# EAGLE design led_arm (EAGLE 5.07)
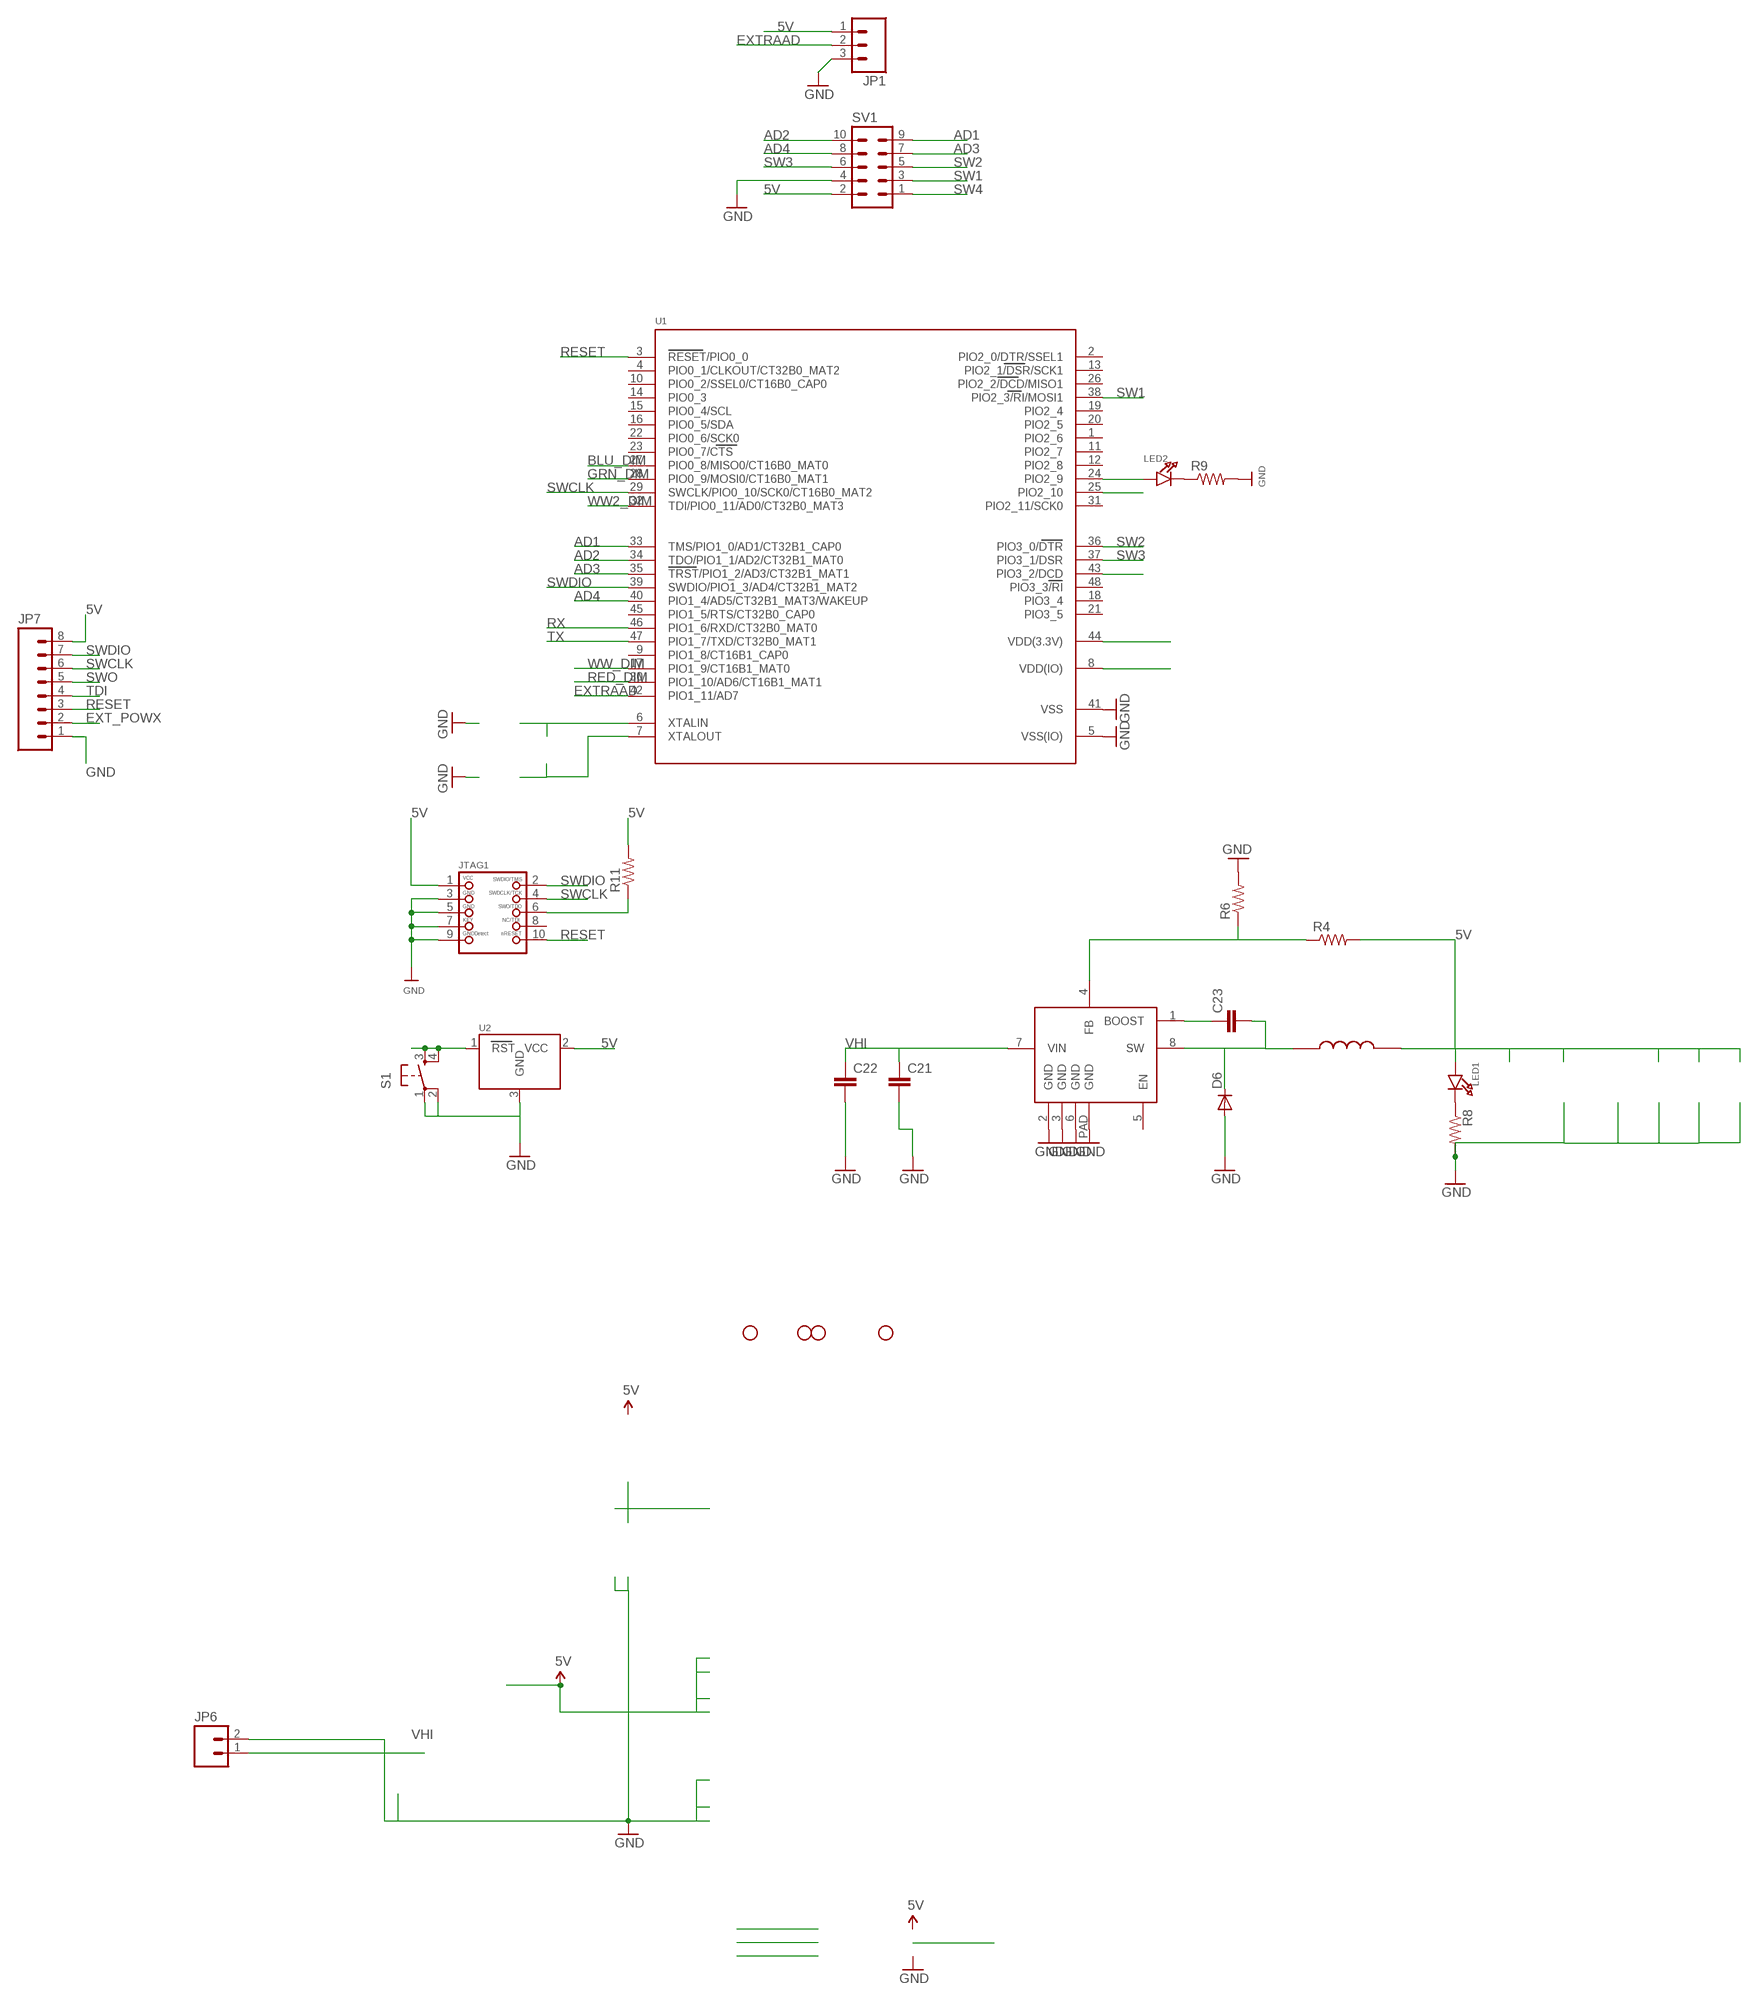
[diagram p0: schematic, sheet 1, part 1 of 2]
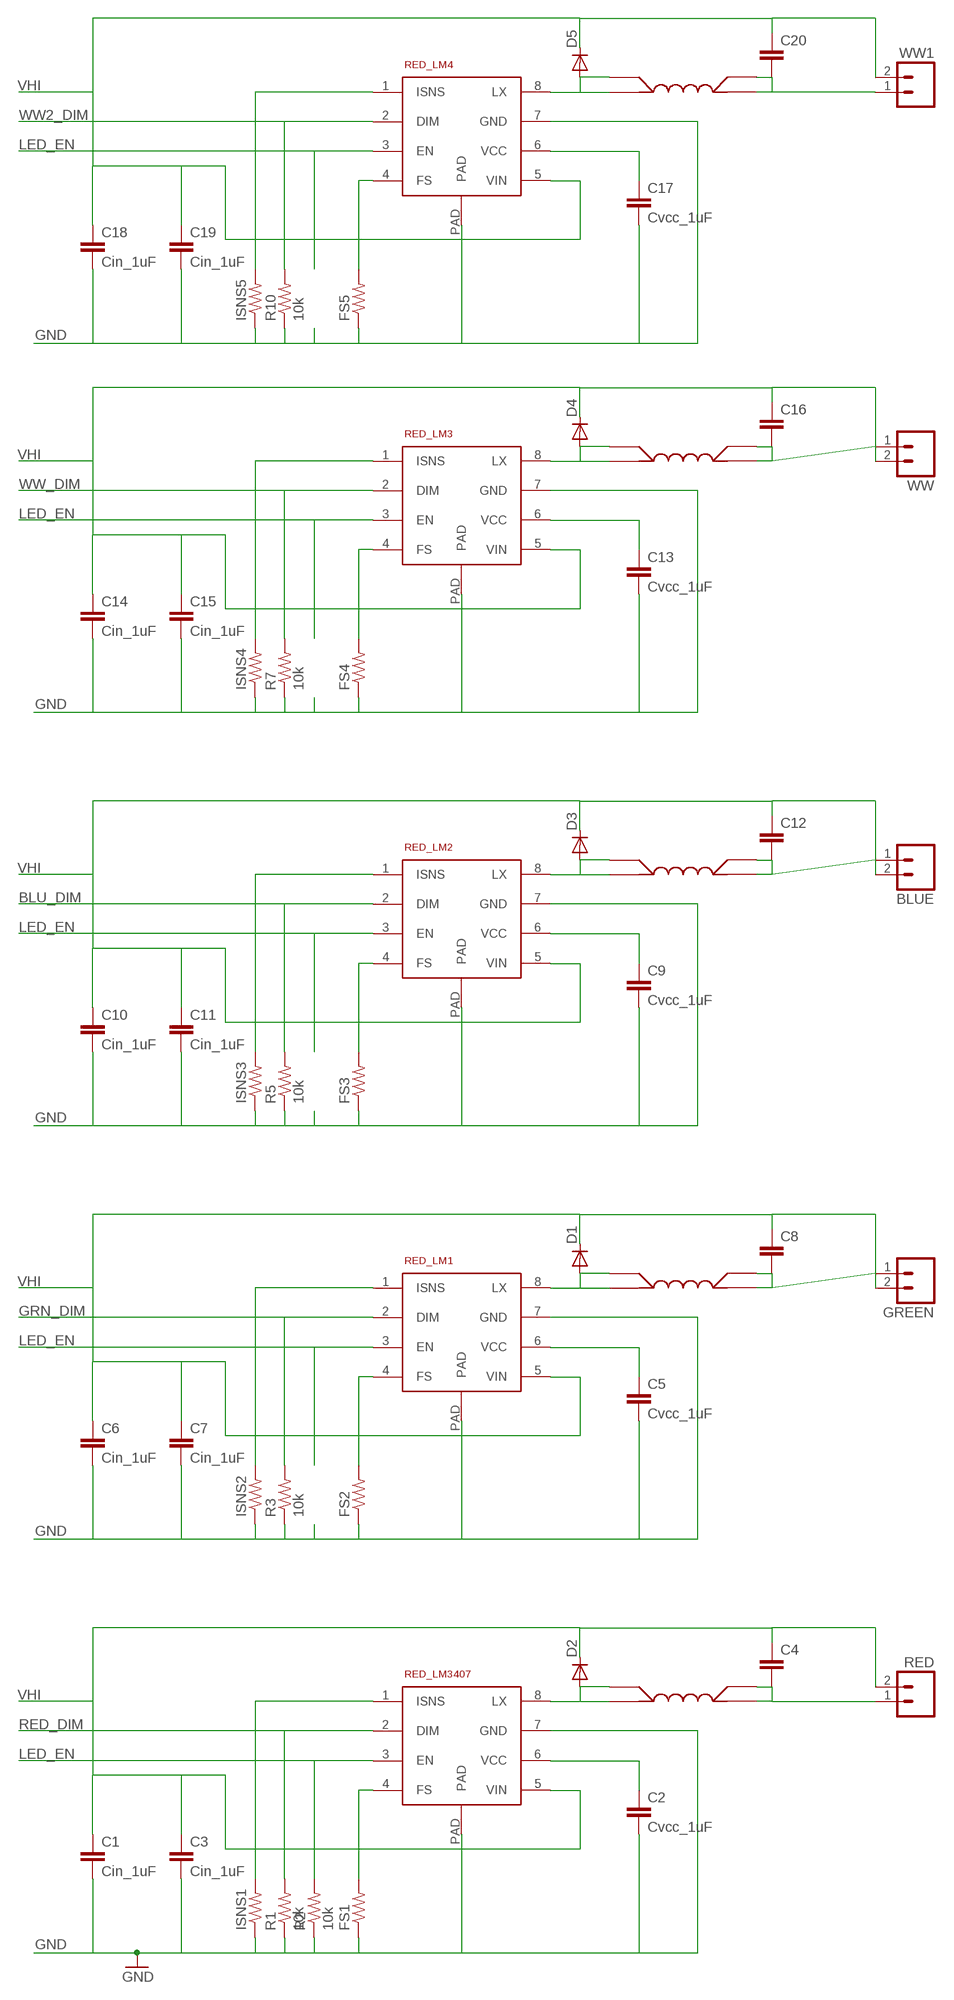
[diagram p1: schematic, sheet 1, part 2 of 2]

## Parts
BLUE  M023.5MM_LOCK  [SCREWTERMINAL-3.5MM-2_LOCK]
C1  Cin_1uF  C-EUC1206  [C1206]
C2  Cvcc_1uF  C-EUC1206  [C1206]
C3  Cin_1uF  C-EUC1206  [C1206]
C4  C-EUC1206  [C1206]
C5  Cvcc_1uF  C-EUC1206  [C1206]
C6  Cin_1uF  C-EUC1206  [C1206]
C7  Cin_1uF  C-EUC1206  [C1206]
C8  C-EUC1206  [C1206]
C9  Cvcc_1uF  C-EUC1206  [C1206]
C10  Cin_1uF  C-EUC1206  [C1206]
C11  Cin_1uF  C-EUC1206  [C1206]
C12  C-EUC1206  [C1206]
C13  Cvcc_1uF  C-EUC1206  [C1206]
C14  Cin_1uF  C-EUC1206  [C1206]
C15  Cin_1uF  C-EUC1206  [C1206]
C16  C-EUC1206  [C1206]
C17  Cvcc_1uF  C-EUC1206  [C1206]
C18  Cin_1uF  C-EUC1206  [C1206]
C19  Cin_1uF  C-EUC1206  [C1206]
C20  C-EUC1206  [C1206]
C21  C-EUC3216  [C3216]
C22  C-EUC0805  [C0805]
C23  C-EUC0805  [C0805]
D1  DIODESMA  [SMA-DIODE]
D2  DIODESMA  [SMA-DIODE]
D3  DIODESMA  [SMA-DIODE]
D4  DIODESMA  [SMA-DIODE]
D5  DIODESMA  [SMA-DIODE]
D6  DIODESMB  [SMB-DIODE]
FS1  RESISTOR  [0805]
FS2  RESISTOR  [0805]
FS3  RESISTOR  [0805]
FS4  RESISTOR  [0805]
FS5  RESISTOR  [0805]
GREEN  M023.5MM_LOCK  [SCREWTERMINAL-3.5MM-2_LOCK]
ISNS1  RESISTOR  [0805]
ISNS2  RESISTOR  [0805]
ISNS3  RESISTOR  [0805]
ISNS4  RESISTOR  [0805]
ISNS5  RESISTOR  [0805]
JP1  M03LOCK_LONGPADS  [1X03_LOCK_LONGPADS]
JP2  STAND-OFF  [STAND-OFF]
JP3  STAND-OFF  [STAND-OFF]
JP4  STAND-OFF  [STAND-OFF]
JP5  STAND-OFF  [STAND-OFF]
JP6  M02  [1X02_LONGPADS]
JP7  M08  [1X08]
JTAG1  JTAG-CORTEXM3  [2X05_1.27MM_SMT]
LED1  LED0805  [CHIPLED_0805]
LED2  LED0805  [CHIPLED_0805]
R1  10k  RESISTOR  [0805]
R2  10k  RESISTOR  [0805]
R3  10k  RESISTOR  [0805]
R4  RESISTOR  [0805]
R5  10k  RESISTOR  [0805]
R6  RESISTOR  [0805]
R7  10k  RESISTOR  [0805]
R8  RESISTOR  [0805]
R9  RESISTOR  [0805]
R10  10k  RESISTOR  [0805]
R11  RESISTOR  [0805]
RED  M023.5MM_LOCK  [SCREWTERMINAL-3.5MM-2_LOCK]
RED_LM1  LM3407  [LM3407]
RED_LM2  LM3407  [LM3407]
RED_LM3  LM3407  [LM3407]
RED_LM4  LM3407  [LM3407]
RED_LM3407  LM3407  [LM3407]
S1  TAC_SWITCHPTH  [TACTILE-PTH]
SV1  ML10  [ML10]
U1  LPC1113/4  [LQFP48]
U2  MCP130TREFLOW  [SOT23-R]
U$1  SRR4018  [SDR0805]
U$2  SRR4018  [SDR0805]
U$3  SRR4018  [SDR0805]
U$4  SRR4018  [SDR0805]
U$11  SRR4018  [SDR0805]
U$13  LM22675  [PSOP-8]
U$14  INDUCTOR  [SRU1038]
WW  M023.5MM_LOCK  [SCREWTERMINAL-3.5MM-2_LOCK]
WW1  M023.5MM_LOCK  [SCREWTERMINAL-3.5MM-2_LOCK]

## Nets
5V: JP1.1 JP7.8 JTAG1.1 LED1.A R4.2 R11.2 SV1.2 U1.8(VDD(IO)) U1.44(VDD(3.3V)) U2.2(VCC) U$14.P$2
AD1: SV1.9 U1.33(TMS/PIO1_0/AD1/CT32B1_CAP0)
AD2: SV1.10 U1.34(TDO/PIO1_1/AD2/CT32B1_MAT0)
AD3: SV1.7 U1.35(TRST/PIO1_2/AD3/CT32B1_MAT1)
AD4: SV1.8 U1.40(PIO1_4/AD5/CT32B1_MAT3/WAKEUP)
BLU_DIM: R5.2 RED_LM2.2(DIM) U1.27(PIO0_8/MISO0/CT16B0_MAT0)
EXT_POWX: JP7.2
EXTRAAD: JP1.2 U1.42(PIO1_11/AD7)
GND: C1.2 C2.2 C3.2 C5.2 C6.2 C7.2 C9.2 C10.2 C11.2 C13.2 C14.2 C15.2 C17.2 C18.2 C19.2 C21.2 C22.2 D6.A FS1.1 FS2.1 FS3.1 FS4.1 FS5.1 ISNS1.1 ISNS2.1 ISNS3.1 ISNS4.1 ISNS5.1 JP1.3 JP6.2 JP7.1 JTAG1.3 JTAG1.5 JTAG1.7 JTAG1.9 R1.1 R2.1 R3.1 R5.1 R6.2 R7.1 R8.2 R9.2 R10.1 RED_LM1.7(GND) RED_LM1.PAD RED_LM2.7(GND) RED_LM2.PAD RED_LM3.7(GND) RED_LM3.PAD RED_LM4.7(GND) RED_LM4.PAD RED_LM3407.7(GND) RED_LM3407.PAD S1.1 S1.2 SV1.4 U1.5(VSS(IO)) U1.41(VSS) U2.3(GND) U$13.2(GND) U$13.3(GND) U$13.6(GND) U$13.PAD(GND)
GRN_DIM: R3.2 RED_LM1.2(DIM) U1.28(PIO0_9/MOSI0/CT16B0_MAT1)
LED_EN: R2.2 RED_LM1.3(EN) RED_LM2.3(EN) RED_LM3.3(EN) RED_LM4.3(EN) RED_LM3407.3(EN) U1.25(PIO2_10)
N$1: C5.1 RED_LM1.6(VCC)
N$2: FS2.2 RED_LM1.4(FS)
N$3: C2.1 RED_LM3407.6(VCC)
N$4: ISNS2.2 RED_LM1.1(ISNS)
N$5: FS1.2 RED_LM3407.4(FS)
N$6: ISNS1.2 RED_LM3407.1(ISNS)
N$7: D2.A RED_LM3407.8(LX) U$2.1A U$2.1B
N$8: D1.A RED_LM1.8(LX) U$1.1A U$1.1B
N$9: R4.1 R6.1 U$13.4(FB)
N$10: C8.2 GREEN.1 U$1.2A U$1.2B
N$11: C9.1 RED_LM2.6(VCC)
N$12: FS3.2 RED_LM2.4(FS)
N$13: ISNS3.2 RED_LM2.1(ISNS)
N$14: D3.A RED_LM2.8(LX) U$3.1A U$3.1B
N$15: BLUE.1 C12.2 U$3.2A U$3.2B
N$16: C13.1 RED_LM3.6(VCC)
N$17: FS4.2 RED_LM3.4(FS)
N$18: ISNS4.2 RED_LM3.1(ISNS)
N$19: D4.A RED_LM3.8(LX) U$4.1A U$4.1B
N$20: C16.2 U$4.2A U$4.2B WW.1
N$21: LED1.C R8.1
N$23: LED2.A U1.24(PIO2_9)
N$24: LED2.C R9.1
N$26: C17.1 RED_LM4.6(VCC)
N$27: FS5.2 RED_LM4.4(FS)
N$28: ISNS5.2 RED_LM4.1(ISNS)
N$29: D5.A RED_LM4.8(LX) U$11.1A U$11.1B
N$33: C23.1 U$13.1(BOOST)
N$34: C23.2 D6.C U$13.8(SW) U$14.P$1
N$36: C4.2 RED.1 U$2.2A U$2.2B
N$37: U1.7(XTALOUT)
N$38: U1.6(XTALIN)
N$41: JTAG1.6 R11.1
N$322: C20.2 U$11.2A U$11.2B WW1.1
RED_DIM: R1.2 RED_LM3407.2(DIM) U1.30(PIO1_10/AD6/CT16B1_MAT1)
RESET: JP7.3 JTAG1.10 S1.3 S1.4 U1.3(RESET/PIO0_0) U2.1(RST)
RX: U1.46(PIO1_6/RXD/CT32B0_MAT0)
SW1: SV1.3 U1.38(PIO2_3/RI/MOSI1)
SW2: SV1.5 U1.36(PIO3_0/DTR)
SW3: SV1.6 U1.37(PIO3_1/DSR)
SW4: SV1.1 U1.43(PIO3_2/DCD)
SWCLK: JP7.6 JTAG1.4 U1.29(SWCLK/PIO0_10/SCK0/CT16B0_MAT2)
SWDIO: JP7.7 JTAG1.2 U1.39(SWDIO/PIO1_3/AD4/CT32B1_MAT2)
SWO: JP7.5
TDI: JP7.4
TX: U1.47(PIO1_7/TXD/CT32B0_MAT1)
VHI: BLUE.2 C1.1 C3.1 C4.1 C6.1 C7.1 C8.1 C10.1 C11.1 C12.1 C14.1 C15.1 C16.1 C18.1 C19.1 C20.1 C21.1 C22.1 D1.C D2.C D3.C D4.C D5.C GREEN.2 JP6.1 RED.2 RED_LM1.5(VIN) RED_LM2.5(VIN) RED_LM3.5(VIN) RED_LM4.5(VIN) RED_LM3407.5(VIN) U$13.7(VIN) WW1.2 WW.2
WW2_DIM: R10.2 RED_LM4.2(DIM) U1.32(TDI/PIO0_11/AD0/CT32B0_MAT3)
WW_DIM: R7.2 RED_LM3.2(DIM) U1.17(PIO1_9/CT16B1_MAT0)
Unconnected: JTAG1.8 U1.1(PIO2_6) U1.2(PIO2_0/DTR/SSEL1) U1.4(PIO0_1/CLKOUT/CT32B0_MAT2) U1.9(PIO1_8/CT16B1_CAP0) U1.10(PIO0_2/SSEL0/CT16B0_CAP0) U1.11(PIO2_7) U1.12(PIO2_8) U1.13(PIO2_1/DSR/SCK1) U1.14(PIO0_3) U1.15(PIO0_4/SCL) U1.16(PIO0_5/SDA) U1.18(PIO3_4) U1.19(PIO2_4) U1.20(PIO2_5) U1.21(PIO3_5) U1.22(PIO0_6/SCK0) U1.23(PIO0_7/CTS) U1.26(PIO2_2/DCD/MISO1) U1.31(PIO2_11/SCK0) U1.45(PIO1_5/RTS/CT32B0_CAP0) U1.48(PIO3_3/RI) U$13.5(EN)

## Library data of the parts
BLUE GREEN JP6 RED WW WW1 = SparkFun:M02: Header 2 Standard 2-pin 0.1" header. Use with straight break away headers (SKU : PRT-00116), right angle break away headers (PRT-00553), swiss pins (PRT-00743), machine pins (PRT-00117), and female headers (PRT-00115). Molex polarized connector foot print use with SKU : PRT-08233 with associated crimp pins and housings.
C1-C3 C5-C7 C9-C11 C13-C15 C17-C19 = resistor:C-EU: CAPACITOR, European symbol
C4 C8 C12 C16 C20-C23 = rcl:C-EU: CAPACITOR, European symbol
D1-D6 = SparkFun:DIODE: Diode These are standard reverse protection diodes and small signal diodes. SMA package can handle up to about 1A. SOD-323 can handle about 200mA. What the SOD-323 package when ordering, there are some mfgs out there that are 5-pin packages.
FS1-FS5 ISNS1-ISNS5 R1-R11 = SparkFun:RESISTOR: Resistor Basic schematic elements and footprints for 0603, 1206, and PTH 1/10th watt (small) resistors.
JP1 = SparkFun:M03: Header 3 Standard 3-pin 0.1" header. Use with straight break away headers (SKU : PRT-00116), right angle break away headers (PRT-00553), swiss pins (PRT-00743), machine pins (PRT-00117), and female headers (PRT-00115). Molex polarized connector foot print use with SKU : PRT-08232 with associated crimp pins and housings.
JP2-JP5 = SparkFun:STAND-OFF: Stand Off This is the mechanical footprint for a #4 phillips button head screw. Use the keepout ring to avoid running the screw head into surrounding components. SKU : PRT-00447
JP7 = SparkFun:M08: Header 8 Standard 8-pin 0.1" header. Use with straight break away headers (SKU : PRT-00116), right angle break away headers (PRT-00553), swiss pins (PRT-00743), machine pins (PRT-00117), and female headers (PRT-00115).
JTAG1 = microbuilder:JTAG-CORTEXM3: Serial Wire (SW-DP) Connector This standard 0.05" 10-pin connector is for use with the Cortex M0/M3's native SWD (serial wire debugger) interface (SW-DP). Some boards support a 20-pin combined JTAG+SWD connector (SWJ-DP), such as the LPC1700 family, but many smaller devices only work with SWD which typically use the smaller 10-pin SW-DP connecter (the LPC1300 family, for example, only supports SWD). 2x05 1.27mm/0.05" Connector: This is the standard SMT connector defined by ARM for all Cortex devices, and should be used in most situations and for forward-compatibility since any new devices coming to market will likely ise this connector. MOLEX 10 Pin 0.1" Connector: This 0.1" 10 pin connector has the same pin layout as the standard 0.05" connector, but is easier to work with if you are using standard jumper wires or custom cables to connect your SWD hardware. MOLEX 20 Pin 0.1" Connector: This 0.1" 20 pin connector is the same model used for ARM7/ARM9 JTAG debuggers, but is connected to match the pins on the Segger J-Link for ARM (which supports both JTAG and SWD debugging). See the following document from ARM for more information on Cortex M3 Debug Connectors: http://infocenter.arm.com/help/topic/com.arm.doc.faqs/attached/13634/cortex_debug_connectors.pdf And the following page for an overview with images of the different connector types: http://www.keil.com/peripherals/coresight/connectors.asp
LED1 LED2 = microbuilder:LED: LED 0603 - 0603 Surface Mount Package Green LED - Low Power (3.9mcd, 2ma, 1.7Vf) Orange LED - Low Power (9.8mcd, 2ma, 1.8Vf) Red LED - Low Power (5mcd, 2ma, 1.8Vf) Yellow LED - Low Power (7mcd, 2ma, 1.8Vf) 0805 - 0805 Surface Mount Package Red LED (104mcd, 20mA, Diffused) - LS R976 [Digikey: 475-1278-6-ND] Red LED (12mcd, 20mA, 2.0Vf, Clear) - APT2012EC [Digikey: 754-1128-1-ND] Green LED (15mcd, 20mA, 2.2Vf, Clear) - APT2012GC [Digikey: 754-1131-1-ND] White LED (160mcd, 20mA, 2.1Vf, Clear) - APT2012SECK [Digikey: 754-1130-1-ND] 1206 - 1206 Surface Mount Package Green LED (26mcd, 20mA, Diffused) - LG N971 [Digikey: 475-1407-6-ND] Red LED (15mcd, 20mA, Diffused) - LH N974 [Digikey: 475-1416-6-ND]
RED_LM1-RED_LM4 RED_LM3407 = JoesCustom:LM3407
S1 = SparkFun:TAC_SWITCH: Momentary Switch Button commonly used for reset or general input. Spark Fun Electronics SKU : COM-00097
SV1 = con-harting-ml:ML10: HARTING
U1 = microbuilder:LPC1113/4: LPC1113/4 MCU QFP48 Package ARM Cortex M0, 50MHz Operation, 8 Channel 10-Bit ADC, 1²C, 2xSPI, UART, 2x16 Bit and 2x32 Bit Timers, Internal 12MHz Oscillator, 1.8-3.6V operation. Model Flash SRAM Part N°: Digikey # LPC1113 24KB 8KB LPC1113FBD48/301 TBD LPC1114 32KB 8KB LPC1114FBD48/301 TBD
U2 = microbuilder:MCP130T: MCP130T Voltage Supervisor (Active Low) Voltage supervisors will put the MCU in a reset state if the voltage drops below a pre-determined level. SOT23-R/SOT23-W: Voltage Supervisor - 3.15V Active Low Note: Use the "Reflow" footprint when working with solder paste, and the "Wave" footprint when soldering by hand with a soldering iron (the latter has larger pads that are easier to solder by hand). Digikey: MCP130T-315I/TTCT-ND
U$1-U$4 U$11 = JoesCustom:SRR4018
U$13 = JoesCustom:LM22675
U$14 = JoesCustom:INDUCTOR

## Board
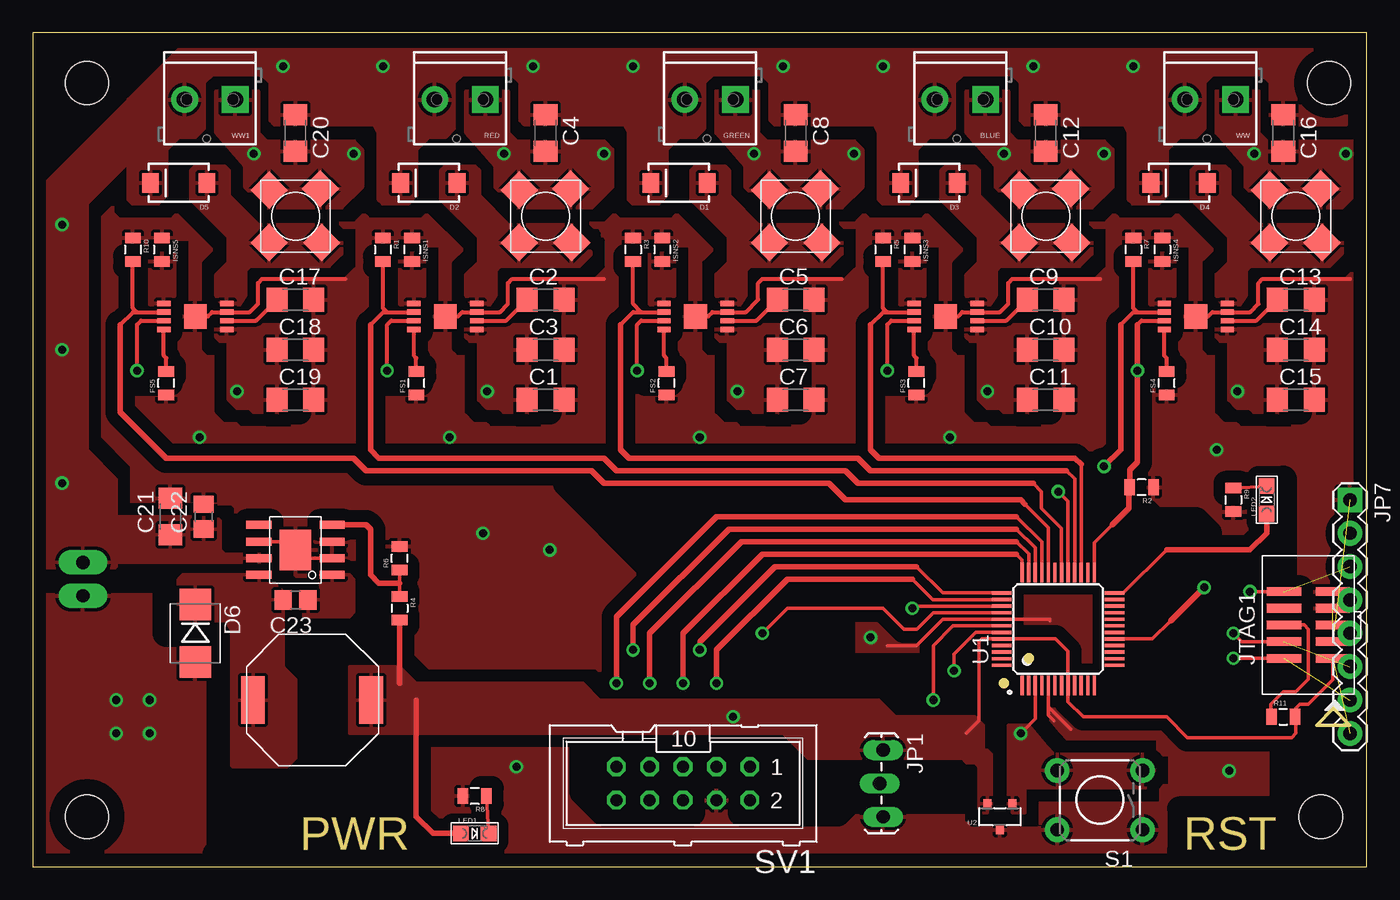
[diagram p2: board, top side]
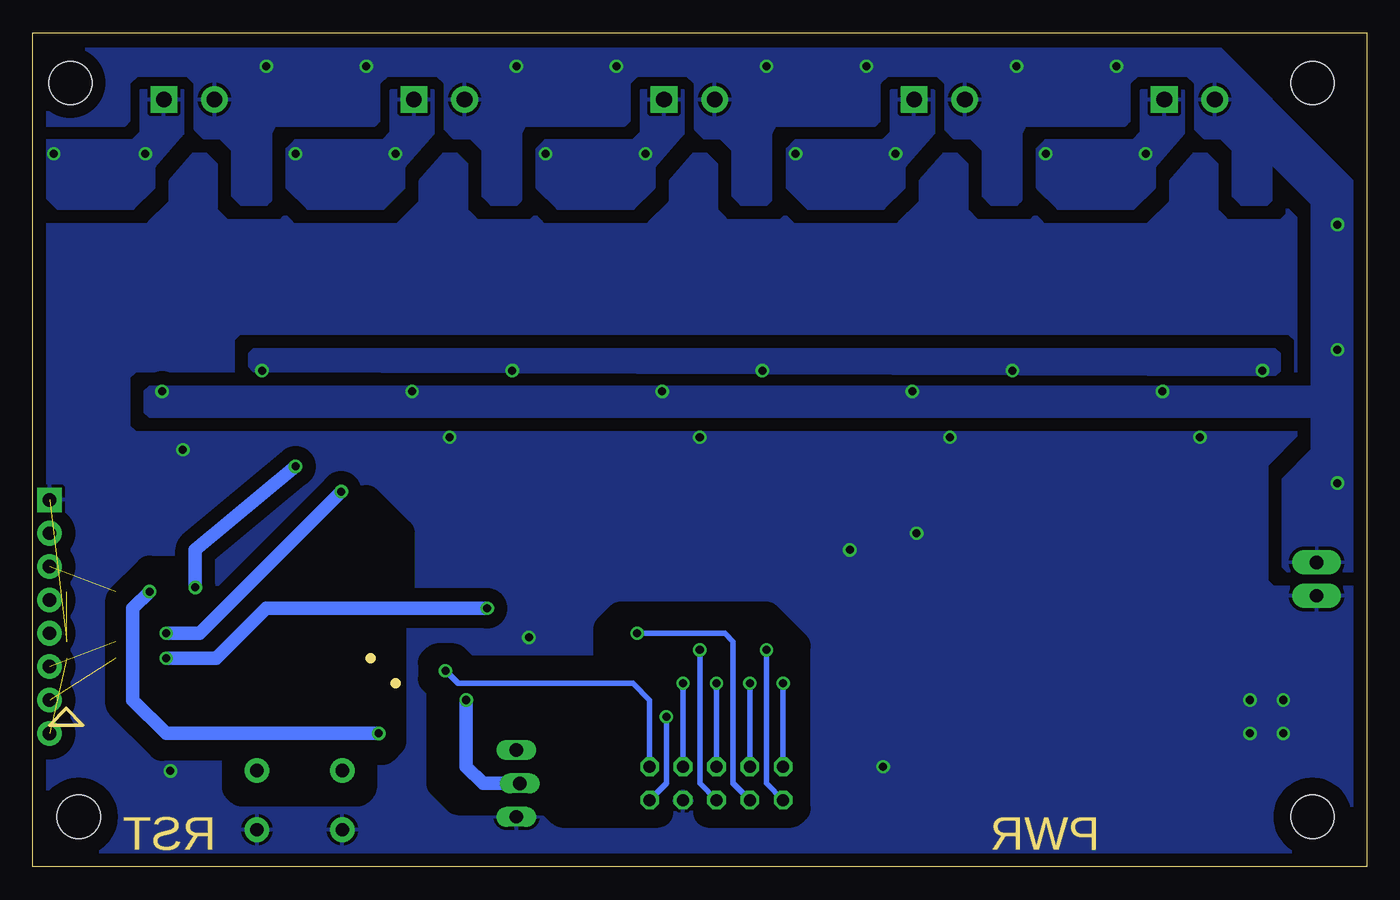
[diagram p3: board, bottom side, seen from below]

Size 101.6 x 63.5 mm. Coordinates in mm from the lower left corner, seen from the top.
Outline: 0,0 101.6,0 101.6,63.5 0,63.5 0,0
Copper layers (1*16): Top 0.035mm / dielectric 1.5mm / Bottom 0.035mm
Design rules "default *": minimum track width 10mil, minimum drill 24mil, track to track 10mil, track to pad 10mil, pad to pad 10mil, via to via 10mil, smd to smd 10mil, copper to edge 40mil, drill to drill 8mil, minimum pad ring 10mil, minimum via ring 8mil, stop-mask expansion 4mil, vias tented up to drill 0mil, thermal gap 10mil
tRestrict: area 19.7,34.6 to 20.3,43.8; area 38.7,34.6 to 39.4,43.8; area 57.8,34.6 to 58.4,43.8; area 76.8,34.6 to 77.5,43.8; area 95.9,34.6 to 96.5,43.8; area 19.7,1.3 to 27.3,4.4; area 87.3,1.3 to 94.9,4.4; 23 lines
bRestrict: 34 lines
Milling: area 97.8,10.8 to 100.3,12.1; area 75.7,15.7 to 76.1,16.1; area 73.8,13.8 to 74.2,14.1

### Footprints (pad centres in the part's own frame; a part is rotated, then mirrored left to right if it is on the bottom)
SCREWTERMINAL-3.5MM-2_LOCK = drill 1.2 pad 2.032 square: 1 -0.178,0 | drill 1.2 pad 2.032 round: 2 3.678,0
C1206 = smd 1.6 x 1.8: 1 -1.4,0; 2 1.4,0
C3216 = smd 1.6 x 1.8: 1 -1.4,0; 2 1.4,0
C0805 = smd 1.3 x 1.5: 1 -0.95,0; 2 0.95,0
SMA-DIODE = smd 1.27 x 1.47: A -2.15,0; C 2.15,0
SMB-DIODE = smd 2.4 x 2.4: A 2.2,0; C -2.2,0
0805 = smd 0.8 x 1.2: 1 -0.9,0; 2 0.9,0
1X03_LOCK_LONGPADS = drill 1.016 long: 1 0,0; 2 2.54,-0.254; 3 5.08,0
STAND-OFF = hole 3.302: 0,0
1X02_LONGPADS = drill 1.016 pad 1.88 long: 1 0,0; 2 2.54,0
1X08 = drill 1.016 pad 1.88 square: 1 0,0 | drill 1.016 pad 1.88 round: 2 2.54,0; 3 5.08,0; 4 7.62,0; 5 10.16,0; 6 12.7,0; 7 15.24,0; 8 17.78,0
2X05_1.27MM_SMT = smd 0.65 x 2.6: 1 -2.54,-1.85; 2 -2.54,1.85; 3 -1.27,-1.85; 4 -1.27,1.85; 5 0,-1.85; 6 0,1.85; 7 1.27,-1.85; 8 1.27,1.85; 9 2.54,-1.85; 10 2.54,1.85
CHIPLED_0805 = smd 1.2 x 1.2: A 0,-1.05; C 0,1.05
LM3407 = smd 0.406 x 1.016: 1 -0.991,-2.4; 2 -0.33,-2.4; 3 0.33,-2.4; 4 0.991,-2.4; 5 0.991,2.4; 6 0.33,2.4; 7 -0.33,2.4; 8 -0.991,2.4 | smd 1.854 x 1.727: PAD 0,0
TACTILE-PTH = drill 1.016 pad 1.88 round: 1 -3.251,2.261; 2 3.251,2.261; 3 -3.251,-2.261; 4 3.251,-2.261
ML10 = drill 0.914 octagon: 1 -5.08,-1.27; 2 -5.08,1.27; 3 -2.54,-1.27; 4 -2.54,1.27; 5 0,-1.27; 6 0,1.27; 7 2.54,-1.27; 8 2.54,1.27; 9 5.08,-1.27; 10 5.08,1.27
LQFP48 = smd 1.5 x 0.25: 1 -4.3,2.75; 2 -4.3,2.25; 3 -4.3,1.75; 4 -4.3,1.25; 5 -4.3,0.75; 6 -4.3,0.25; 7 -4.3,-0.25; 8 -4.3,-0.75; 9 -4.3,-1.25; 10 -4.3,-1.75; 11 -4.3,-2.25; 12 -4.3,-2.75; 25 4.3,-2.75; 26 4.3,-2.25; 27 4.3,-1.75; 28 4.3,-1.25; 29 4.3,-0.75; 30 4.3,-0.25; 31 4.3,0.25; 32 4.3,0.75; 33 4.3,1.25; 34 4.3,1.75; 35 4.3,2.25; 36 4.3,2.75 | smd 0.25 x 1.5: 13 -2.75,-4.3; 14 -2.25,-4.3; 15 -1.75,-4.3; 16 -1.25,-4.3; 17 -0.75,-4.3; 18 -0.25,-4.3; 19 0.25,-4.3; 20 0.75,-4.3; 21 1.25,-4.3; 22 1.75,-4.3; 23 2.25,-4.3; 24 2.75,-4.3; 37 2.75,4.3; 38 2.25,4.3; 39 1.75,4.3; 40 1.25,4.3; 41 0.75,4.3; 42 0.25,4.3; 43 -0.25,4.3; 44 -0.75,4.3; 45 -1.25,4.3; 46 -1.75,4.3; 47 -2.25,4.3; 48 -2.75,4.3
SOT23-R = smd 0.6 x 0.7: 1 -0.95,-1; 2 0.95,-1; 3 0,1
SDR0805 = smd 2 x 2 rotated 45: 1A -2,2; 1B 2,2; 2A -1.9,-2.1; 2B 2,-2
PSOP-8 = smd 0.61 x 1.905: 1 -1.905,-2.781; 2 -0.635,-2.781; 3 0.635,-2.781; 4 1.905,-2.781; 5 1.905,2.781; 6 0.635,2.781; 7 -0.635,2.781; 8 -1.905,2.781 | smd 3.099 x 2.413: PAD 0,0
SRU1038 = smd 1.8 x 3.6: P$1 -4.5,0; P$2 4.5,0

### Placement (x,y rotation side)
BLUE  72.39,58.42 180 top
C1  39.05,35.56 0 top
C2  39.05,43.18 0 top
C3  39.05,39.37 0 top
C4  39.05,55.88 270 top
C5  58.1,43.18 0 top
C6  58.1,39.37 0 top
C7  58.1,35.56 0 top
C8  58.1,55.88 270 top
C9  77.15,43.18 0 top
C10  77.15,39.37 0 top
C11  77.15,35.56 0 top
C12  77.15,55.88 270 top
C13  96.2,43.18 0 top
C14  96.2,39.37 0 top
C15  96.2,35.56 0 top
C16  95.25,55.88 270 top
C17  20,43.18 0 top
C18  20,39.37 0 top
C19  20,35.56 0 top
C20  20,55.88 270 top
C21  10.48,26.67 90 top
C22  13.02,26.67 90 top
C23  20,20.32 180 top
D1  49.21,52.07 180 top
D2  30.16,52.07 180 top
D3  68.26,52.07 180 top
D4  87.31,52.07 180 top
D5  11.11,52.07 180 top
D6  12.38,17.78 270 top
FS1  29.21,36.83 90 top
FS2  48.26,36.83 90 top
FS3  67.31,36.83 90 top
FS4  86.36,36.83 90 top
FS5  10.16,36.83 90 top
GREEN  53.34,58.42 180 top
ISNS1  28.89,46.99 270 top
ISNS2  47.94,46.99 270 top
ISNS3  66.99,46.99 270 top
ISNS4  86.04,46.99 270 top
ISNS5  9.84,46.99 270 top
JP1  64.77,8.89 270 top
JP2  98.11,3.81 0 bottom
JP3  4.13,59.69 0 bottom
JP4  4.13,3.81 0 bottom
JP5  98.74,59.69 0 top
JP6  3.81,23.18 270 bottom
JP7  100.33,27.94 270 top
JTAG1  97.16,18.41 90 top
LED1  33.66,2.54 270 top
LED2  93.98,27.94 0 top
R1  26.67,46.99 270 top
R2  84.45,28.89 180 top
R3  45.72,46.99 270 top
R4  27.94,19.68 270 top
R5  64.77,46.99 270 top
R6  27.94,23.5 90 top
R7  83.82,46.99 270 top
R8  33.66,5.4 180 top
R9  91.44,27.94 270 top
R10  7.62,46.99 270 top
R11  95.25,11.43 0 top
RED  34.29,58.42 180 top
RED_LM1  50.48,41.91 270 top
RED_LM2  69.53,41.91 270 top
RED_LM3  88.58,41.91 270 top
RED_LM4  12.38,41.91 270 top
RED_LM3407  31.43,41.91 270 top
S1  81.28,5.08 180 top
SV1  49.53,6.35 180 top
U1  78.11,18.1 90 top
U2  73.66,3.81 180 top
U$1  58.1,49.53 180 top
U$2  39.05,49.53 180 top
U$3  77.15,49.53 180 top
U$4  96.2,49.53 180 top
U$11  20,49.53 180 top
U$13  20,24.13 90 top
U$14  21.27,12.7 0 top
WW  91.44,58.42 180 top
WW1  15.24,58.42 180 top

### Tracks (layer width: path | path; a pad name or v marks a point on that pad's centre or on a via)
5V  (via drill 0.61)  (1 unrouted)
  Top 0.254: JTAG1.1 99,14.23 97.16,12.38 96.52,12.38 96.2,12.06 96.2,11.48 | 96.2,11.48 R11.2 | 96.2,11.48 96.2,10.16 95.89,9.84 87.95,9.84 86.36,11.43 80.01,11.43 78.86,12.59 U1.8 78.86,16.39 77.9,17.35 U1.44 72.28,17.35 72.07,17.14 72.07,11.11 71.12,10.16 | U$14.P$2 25.72,12.76
  Top 0.406: 27.94,13.97 R4.2 | LED1.A 30.48,2.54 29.21,3.81 29.21,12.7
  Bottom 0.406: v53.34,11.43 53.34,6.35 SV1.2
  pour Top (isolate 0.61): 57.15,10.16 24.13,10.16 24.13,15.24 27.94,15.24 29.21,13.97 41.91,13.97 43.18,12.7 64.45,12.7 65.72,11.43 71.75,11.43 72.39,10.79 72.39,8.89 71.75,8.26 59.05,8.26
  pour Top (isolate 0.61): 70.8,8.89 72.71,8.89 73.03,8.57 73.03,4.45 72.71,4.13 72.39,4.13 72.07,4.45 72.07,7.62 71.75,7.94 71.12,7.94 70.8,8.26
AD1  (via drill 0.61)
  Top 0.254: U1.33 76.86,24.75 74.93,26.67
  Top 0.406: 74.93,26.67 52.07,26.67 44.45,19.05 v44.45,13.97
  Bottom 0.406: SV1.9 v44.45,13.97
AD2  (via drill 0.61)
  Top 0.254: U1.34 76.36,24.29 74.93,25.72
  Top 0.406: 74.93,25.72 53.02,25.72 45.72,18.41 v45.72,16.51
  Bottom 0.406: v45.72,16.51 45.72,6.35 SV1.10
AD3  (via drill 0.61)
  Top 0.254: U1.35 75.86,23.84 74.93,24.77
  Top 0.406: 74.93,24.77 53.98,24.77 46.99,17.78 v46.99,13.97
  Bottom 0.406: SV1.7 v46.99,13.97
AD4  (via drill 0.61)
  Top 0.254: U1.40 68.6,19.35 67.35,18.1 66.36,18.1 64.77,19.68 57.47,19.68 v55.56,17.78
  Bottom 0.406: SV1.8 48.26,6.35 48.26,17.14 48.9,17.78 v55.56,17.78
BLU_DIM
  Top 0.254: 79.86,30.64 U1.27
  Top 0.305: 65.08,42.24 64.77,42.55 R5.2 | 65.08,42.24 64.78,42.24 63.82,41.27 | 65.08,42.24 RED_LM2.2
  Top 0.406: 79.86,30.64 79.38,31.11 64.45,31.11 63.82,31.75 63.82,41.27
EXTRAAD  (via drill 0.61)
  Top 0.254: U1.42 70.1,18.35 68.58,16.83 v68.58,12.7
  Bottom 1.016: v68.58,12.7 68.58,7.62 67.31,6.35 JP1.2
GND  (via drill 0.61)  (4 unrouted)
  Top 0.254: 77.79,11.11 77.36,11.54 U1.5 77.36,12.18 79.06,10.48 | 20.95,23.5 U$13.2 | U$13.6 19.37,24.77 | 65.09,16.83 67.31,16.83 69.33,18.85 U1.41 77.47,18.85 77.47,18.73
  Top 0.305: RED_LM4.PAD 13.34,41.91 13.65,42.23 14.8,42.23 | 14.8,42.23 14.92,42.23 | 14.8,42.23 RED_LM4.7 16.52,42.24 17.14,42.86 17.14,44.45 17.46,44.77 23.81,44.77 | RED_LM3407.PAD 32.38,41.91 32.72,42.24 RED_LM3407.7 35.57,42.24 36.2,42.86 36.2,44.45 36.51,44.77 43.5,44.77 | RED_LM1.PAD 51.44,41.91 51.75,42.23 52.87,42.23 RED_LM1.7 54.3,42.24 55.24,43.18 55.24,44.45 55.56,44.77 61.59,44.77 | RED_LM2.PAD 70.48,41.91 70.8,42.23 71.92,42.23 | 71.92,42.23 RED_LM2.7 | RED_LM3.PAD 89.53,41.91 89.85,42.23 90.97,42.23 RED_LM3.7 92.72,42.24 93.34,42.86 93.34,44.45 93.66,44.77 100.33,44.77 | 20.95,23.5 20.64,23.5 U$13.PAD 19.37,24.77 | 71.92,42.23 73.66,42.23 74.3,42.86 74.3,44.45 74.61,44.77 81.28,44.77
  other vias: 91.12,7.3 34.29,25.4 39.37,24.13 36.83,7.62 6.35,10.16 63.82,17.46 31.75,32.7 50.8,32.7 69.85,32.7 12.7,32.7 90.17,31.75 6.35,12.7 8.89,12.7 8.89,10.16
  pour Bottom (isolate 1.016, rank 3): 0,63.5 0,0 101.6,0 101.6,63.5
  pour Top (isolate 0.914, rank 3): 0,63.5 0,0 101.6,0 101.6,63.5
GRN_DIM
  Top 0.254: U1.28 79.36,29.55 78.74,30.16
  Top 0.305: 46.34,42.24 45.72,42.86 R3.2 | 46.34,42.24 45.73,42.24 44.77,41.27 | 46.34,42.24 RED_LM1.2
  Top 0.406: 78.74,30.16 63.82,30.16 62.87,31.11 45.4,31.11 44.77,31.75 44.77,41.27
LED_EN  (via drill 0.61)
  Top 0.254: 83.77,29.21 83.82,29.21 83.56,28.95 R2.2 | U1.25 80.86,24.66 82.23,26.04
  Top 0.305: RED_LM4.3 8.24,41.58 7.94,41.27 v7.94,37.78 | RED_LM3407.3 27.29,41.58 26.99,41.27 v26.99,37.78 | RED_LM1.3 46.34,41.58 46.04,41.27 v46.04,37.78 | RED_LM2.3 65.39,41.58 65.09,41.27 v65.09,37.78 | RED_LM3.3 84.44,41.58 84.14,41.27
  Top 0.406: 84.14,41.27 v84.14,37.78 84.14,30.8 83.56,30.21 R2.2 83.5,28.84 83.5,27.3 82.23,26.04
  pour Bottom: 6.99,37.47 84.77,37.78 85.09,38.1 85.09,39.05 84.77,39.37 6.99,39.37 6.67,39.05 6.67,37.78
N$1
  Top 0.305: RED_LM1.6 55.1,41.58 C5.1
N$2
  Top 0.305: RED_LM1.4 48.08,38.91 48.26,38.73 FS2.2
N$3
  Top 0.305: RED_LM3407.6 36.05,41.58 C2.1
N$4
  pour Top (isolate 0.305): 48.26,42.86 48.9,43.5 48.9,46.67 46.99,46.67 46.99,42.86 47.31,42.55
N$5
  Top 0.305: RED_LM3407.4 29.03,38.91 29.21,38.73 FS1.2
N$6
  pour Top (isolate 0.305): 29.21,42.86 29.84,43.5 29.84,46.67 27.94,46.67 27.94,42.86 28.26,42.55
N$7
  pour Top (isolate 0.305): 36.2,48.9 41.27,48.9 42.55,46.67 41.59,45.72 35.56,45.72 35.24,45.4 35.24,43.5 34.61,42.55 33.66,42.55 33.02,43.5 33.02,45.09 33.97,46.04 33.97,47.94 31.11,50.8 31.11,53.02 31.43,53.34 33.66,53.34 33.97,53.02 33.97,51.12
N$8
  pour Top (isolate 0.305): 55.24,48.9 60.33,48.9 61.59,47.62 61.59,46.67 60.64,45.72 54.61,45.72 54.29,45.4 54.29,43.5 53.66,42.55 52.7,42.55 52.07,43.5 52.07,45.09 53.02,46.04 53.02,47.94 50.16,50.8 50.16,53.02 50.48,53.34 52.7,53.34 53.02,53.02 53.02,51.12
N$9
  Top 0.254: R6.1 27.94,21.59 R4.1
  Top 0.406: U$13.4 25.4,26.04 25.72,25.72 25.72,22.23 26.35,21.59 27.94,21.59
N$10  (via drill 0.61)
  other vias: 54.93,54.29 62.55,54.29
  pour Top (isolate 0.406): 61.59,50.16 55.88,50.16 54.29,51.75 54.29,53.34 52.07,55.88 52.07,59.05 55.24,59.05 55.24,55.88 55.88,55.24 62.55,55.24 63.18,54.61 63.18,51.75
  pour Bottom (isolate 0.406): 61.59,50.16 55.88,50.16 54.29,51.75 54.29,53.34 52.07,55.88 52.07,59.05 55.24,59.05 55.24,55.88 55.88,55.24 62.55,55.24 63.18,54.61 63.18,51.75
N$11
  Top 0.305: RED_LM2.6 74.15,41.58 C9.1
N$12
  Top 0.305: RED_LM2.4 67.13,38.91 67.31,38.73 FS3.2
N$13
  pour Top (isolate 0.305): 67.31,42.86 67.94,43.5 67.94,46.67 66.04,46.67 66.04,42.86 66.36,42.55
N$14
  pour Top (isolate 0.305): 74.3,48.9 79.38,48.9 80.64,47.62 80.64,46.67 79.69,45.72 73.66,45.72 73.34,45.4 73.34,43.5 72.71,42.55 71.75,42.55 71.12,43.5 71.12,45.09 72.07,46.04 72.07,47.94 69.22,50.8 69.22,53.02 69.53,53.34 71.75,53.34 72.07,53.02 72.07,51.12
N$15  (via drill 0.61)
  other vias: 73.98,54.29 81.6,54.29
  pour Top (isolate 0.406): 80.64,50.16 74.93,50.16 73.34,51.75 73.34,53.34 71.12,55.88 71.12,59.05 74.3,59.05 74.3,55.88 74.93,55.24 81.6,55.24 82.23,54.61 82.23,51.75
  pour Bottom (isolate 0.406): 80.64,50.16 74.93,50.16 73.34,51.75 73.34,53.34 71.12,55.88 71.12,59.05 74.3,59.05 74.3,55.88 74.93,55.24 81.6,55.24 82.23,54.61 82.23,51.75
N$16
  Top 0.305: RED_LM3.6 93.2,41.58 C13.1
N$17
  Top 0.305: RED_LM3.4 86.18,38.91 86.36,38.73 FS4.2
N$18
  pour Top (isolate 0.305): 86.36,42.86 87,43.5 87,46.67 85.09,46.67 85.09,42.86 85.41,42.55
N$19
  pour Top (isolate 0.305): 93.34,48.9 98.42,48.9 99.69,47.62 99.69,46.67 98.74,45.72 92.71,45.72 92.39,45.4 92.39,43.5 91.76,42.55 90.81,42.55 90.17,43.5 90.17,45.09 91.12,46.04 91.12,47.94 88.27,50.8 88.27,53.02 88.58,53.34 90.81,53.34 91.12,53.02 91.12,51.12
N$20  (via drill 0.61)
  other vias: 100.01,54.29 93.03,54.29
  pour Top (isolate 0.406): 99.69,50.16 93.98,50.16 92.39,51.75 92.39,53.34 90.17,55.88 90.17,59.05 93.34,59.05 93.34,55.88 93.98,55.24 100.65,55.24 101.28,54.61 101.28,51.75
  pour Bottom (isolate 0.406): 99.69,50.16 93.98,50.16 92.39,51.75 92.39,53.34 90.17,55.88 90.17,59.05 93.34,59.05 93.34,55.88 93.98,55.24 100.65,55.24 101.28,54.61 101.28,51.75
N$21
  Top 0.254: LED1.C R8.1
N$23
  Top 0.254: U1.24 83.08,20.85 86.36,24.13
  Top 0.406: 86.36,24.13 92.71,24.13 93.98,25.4 LED2.A
N$24
  Top 0.254: R9.1 LED2.C
N$26
  Top 0.305: RED_LM4.6 17,41.58 C17.1
N$27
  Top 0.305: RED_LM4.4 9.98,38.91 10.16,38.73 FS5.2
N$28
  pour Top (isolate 0.305): 10.16,42.86 10.79,43.5 10.79,46.67 8.89,46.67 8.89,42.86 9.21,42.55
N$29
  pour Top (isolate 0.305): 17.14,48.9 22.23,48.9 23.5,47.62 23.5,46.67 22.54,45.72 16.51,45.72 16.19,45.4 16.19,43.5 15.56,42.55 14.61,42.55 13.97,43.5 13.97,45.09 14.92,46.04 14.92,47.94 12.06,50.8 12.06,53.02 12.38,53.34 14.61,53.34 14.92,53.02 14.92,51.12
N$33
  pour Top (isolate 0.61): 21.91,22.23 24.13,22.23 24.45,21.91 24.45,19.37 24.13,19.05 20.64,19.05 20.64,20.95 21.91,20.95
N$34
  pour Top (isolate 0.61): 17.78,22.23 11.43,22.23 10.79,21.59 10.79,19.05 11.11,18.73 14.92,18.73 14.92,7.94 15.24,7.62 19.37,7.62 20,8.26 20,14.29 19.05,15.24 19.05,20.95
N$36  (via drill 0.61)
  other vias: 35.88,54.29 43.5,54.29
  pour Bottom (isolate 0.406): 42.55,50.16 36.83,50.16 35.24,51.75 35.24,53.34 33.02,55.88 33.02,59.05 36.2,59.05 36.2,55.88 36.83,55.24 43.5,55.24 44.13,54.61 44.13,51.75
  pour Top (isolate 0.406): 42.55,50.16 36.83,50.16 35.24,51.75 35.24,53.34 33.02,55.88 33.02,59.05 36.2,59.05 36.2,55.88 36.83,55.24 43.5,55.24 44.13,54.61 44.13,51.75
N$41
  Top 0.254: JTAG1.6 96.84,18.41 97.16,18.1 97.16,14.29 96.2,13.34 95.25,13.34 94.3,12.38 94.3,11.48 R11.1
N$322  (via drill 0.61)
  Top 0.305: U$11.2A 21.58,51.63
  other vias: 16.83,54.29 24.45,54.29
  pour Top (isolate 0.406): 23.5,50.16 17.78,50.16 16.19,51.75 16.19,53.34 13.97,55.88 13.97,59.05 17.14,59.05 17.14,55.88 17.78,55.24 24.45,55.24 25.08,54.61 25.08,51.75
  pour Bottom (isolate 0.406): 23.5,50.16 17.78,50.16 16.19,51.75 16.19,53.34 13.97,55.88 13.97,59.05 17.14,59.05 17.14,55.88 17.78,55.24 24.45,55.24 25.08,54.61 25.08,51.75
RED_DIM
  Top 0.254: U1.30 78.36,25.79 76.83,27.3 76.83,28.57 76.2,29.21
  Top 0.305: 26.98,42.24 RED_LM3407.2 | 26.98,42.24 26.67,42.55 R1.2 | 26.98,42.24 26.68,42.24 25.72,41.27
  Top 0.406: 76.2,29.21 62.87,29.21 61.91,30.16 44.45,30.16 43.5,31.11 26.35,31.11 25.72,31.75 25.72,41.27
RESET  (via drill 0.61)  (1 unrouted)
  Top 0.254: v92.71,20.95 JTAG1.10 | U1.3 76.36,11.27 v75.25,10.16
  Bottom 1.016: v92.71,20.95 93.98,19.68 93.98,12.7 91.44,10.16 v75.25,10.16
  pour Top (isolate 0.61): 74.61,4.13 74.3,4.45 74.3,10.79 75.88,10.79 77.15,9.21 77.79,8.57 85.09,8.57 85.41,8.26 85.41,6.67 84.77,6.03 75.56,6.03 75.56,4.13
SW1  (via drill 0.61)
  Top 0.254: U1.38 68.55,20.35 66.99,21.91
  Top 0.406: 66.99,21.91 57.47,21.91 52.07,16.51 v52.07,13.97
  Bottom 0.406: SV1.3 v52.07,13.97
SW2  (via drill 0.61)
  Top 0.254: 75.36,22.43 U1.36 75.36,23.39 74.93,23.81
  Top 0.406: 74.93,23.81 55.56,23.81 49.53,17.78 v49.53,13.97
  Bottom 0.406: SV1.5 v49.53,13.97
SW3  (via drill 0.61)
  Top 0.254: U1.37 69.32,20.85 67.31,22.86
  Top 0.406: 67.31,22.86 56.52,22.86 50.8,17.14 v50.8,16.51
  Bottom 0.406: v50.8,16.51 50.8,6.35 SV1.6
SW4  (via drill 0.61)
  Top 0.254: v70.17,14.92 70.17,16.19 71.82,17.85 U1.43
  Bottom 0.406: SV1.1 54.61,12.7 55.88,13.97 69.22,13.97 v70.17,14.92
SWCLK  (via drill 0.61)  (1 unrouted)
  Top 0.254: U1.29 78.86,27.82 v78.11,28.57 | JTAG1.4 92.08,17.14 v91.44,17.78
  Bottom 1.016: v78.11,28.57 88.9,17.78 v91.44,17.78
SWDIO  (via drill 0.61)  (1 unrouted)
  Top 0.254: v91.44,15.88 JTAG1.2 | 67.31,19.68 v66.99,19.68 67.16,19.85 U1.39
  Bottom 1.016: v66.99,19.68 83.82,19.68 87.63,15.88 v91.44,15.88
VHI  (via drill 0.61)
  Top 0.305: 18.73,35.43 C19.1
  Top 0.914: D5.C 8.89,52.14
  other vias: 34.61,36.2 72.71,36.2 91.76,36.2 15.56,36.2 53.66,36.2 19.05,60.96 38.1,60.96 45.72,60.96 26.67,60.96 57.15,60.96 64.77,60.96 76.2,60.96 83.82,60.96 2.22,48.9 2.22,39.37 2.22,29.21
  pour Top (isolate 0.406): 18.1,56.83 18.1,59.69 17.46,60.33 13.65,60.33 13.02,59.69 13.02,56.2 12.38,55.56 11.11,55.56 10.16,54.61 10.16,51.12 9.53,50.48 7.62,50.48 7.3,50.8 7.3,58.42 11.11,62.23 30.16,62.23 26.35,58.42 26.35,55.88 26.04,56.52 18.41,56.52
  pour Top (isolate 0.305): 13.97,41.27 18.73,41.27 18.73,34.61 16.83,34.61 16.51,34.92 15.56,34.92 14.92,35.56 14.92,40.01 14.29,40.01 13.97,40.32
  pour Top (isolate 0.406): 37.15,56.83 37.15,59.69 36.51,60.33 32.7,60.33 32.07,59.69 32.07,56.2 31.43,55.56 30.16,55.56 29.21,54.61 29.21,51.12 28.57,50.48 26.67,50.48 26.35,50.8 26.35,58.42 30.16,62.23 49.21,62.23 45.4,58.42 45.4,55.88 45.09,56.52 37.47,56.52
  pour Top (isolate 0.406): 56.2,56.83 56.2,59.69 55.56,60.33 51.75,60.33 51.12,59.69 51.12,56.2 50.48,55.56 49.21,55.56 48.26,54.61 48.26,51.12 47.62,50.48 45.72,50.48 45.4,50.8 45.4,58.42 49.21,62.23 68.26,62.23 64.45,58.42 64.45,55.88 64.14,56.52 56.52,56.52
  pour Top (isolate 0.406): 75.25,56.83 75.25,59.69 74.61,60.33 70.8,60.33 70.17,59.69 70.17,56.2 69.53,55.56 68.26,55.56 67.31,54.61 67.31,51.12 66.67,50.48 64.77,50.48 64.45,50.8 64.45,58.42 68.26,62.23 87.31,62.23 83.5,58.42 83.5,55.88 83.19,56.52 75.56,56.52
  pour Top (isolate 0.406): 94.3,56.83 94.3,59.69 93.66,60.33 89.85,60.33 89.22,59.69 89.22,56.2 88.58,55.56 87.31,55.56 86.36,54.61 86.36,51.12 85.72,50.48 83.82,50.48 83.5,50.8 83.5,58.42 87.31,62.23 100.01,62.23 100.01,56.52 94.61,56.52
  pour Top (isolate 0.305): 33.02,41.27 37.78,41.27 37.78,34.61 35.88,34.61 35.56,34.92 34.61,34.92 33.97,35.56 33.97,40.01 33.34,40.01 33.02,40.32
  pour Top (isolate 0.305): 52.07,41.27 56.83,41.27 56.83,34.61 54.93,34.61 54.61,34.92 53.66,34.92 53.02,35.56 53.02,40.01 52.39,40.01 52.07,40.32
  pour Top (isolate 0.305): 71.12,41.27 75.88,41.27 75.88,34.61 73.98,34.61 73.66,34.92 72.71,34.92 72.07,35.56 72.07,40.01 71.44,40.01 71.12,40.32
  pour Top (isolate 0.305): 90.17,41.27 94.93,41.27 94.93,34.61 93.03,34.61 92.71,34.92 91.76,34.92 91.12,35.56 91.12,40.01 90.49,40.01 90.17,40.32
  pour Bottom (isolate 0.406): 18.1,56.83 18.1,59.69 17.46,60.33 13.65,60.33 13.02,59.69 13.02,56.2 12.38,55.56 11.11,55.56 10.16,54.61 10.16,51.12 9.53,50.48 7.62,50.48 7.3,50.8 7.3,58.42 11.11,62.23 30.16,62.23 26.35,58.42 26.35,55.88 26.04,56.52 18.41,56.52
  pour Bottom (isolate 0.406): 37.15,56.83 37.15,59.69 36.51,60.33 32.7,60.33 32.07,59.69 32.07,56.2 31.43,55.56 30.16,55.56 29.21,54.61 29.21,51.12 28.57,50.48 26.67,50.48 26.35,50.8 26.35,58.42 30.16,62.23 49.21,62.23 45.4,58.42 45.4,55.88 45.09,56.52 37.47,56.52
  pour Bottom (isolate 0.406): 56.2,56.83 56.2,59.69 55.56,60.33 51.75,60.33 51.12,59.69 51.12,56.2 50.48,55.56 49.21,55.56 48.26,54.61 48.26,51.12 47.62,50.48 45.72,50.48 45.4,50.8 45.4,58.42 49.21,62.23 68.26,62.23 64.45,58.42 64.45,55.88 64.14,56.52 56.52,56.52
  pour Bottom (isolate 0.406): 75.25,56.83 75.25,59.69 74.61,60.33 70.8,60.33 70.17,59.69 70.17,56.2 69.53,55.56 68.26,55.56 67.31,54.61 67.31,51.12 66.67,50.48 64.77,50.48 64.45,50.8 64.45,58.42 68.26,62.23 87.31,62.23 83.5,58.42 83.5,55.88 83.19,56.52 75.56,56.52
  pour Bottom (isolate 0.406): 94.3,56.83 94.3,59.69 93.66,60.33 89.85,60.33 89.22,59.69 89.22,56.2 88.58,55.56 87.31,55.56 86.36,54.61 86.36,51.12 85.72,50.48 83.82,50.48 83.5,50.8 83.5,58.42 87.31,62.23 106.36,62.23 102.55,58.42 102.55,55.88 102.23,56.52 94.61,56.52
  pour Bottom (isolate 0.61): 7.94,59.05 0.32,51.44 0.32,22.86 0.64,22.54 6.03,22.54 6.35,22.86 6.35,29.53 4.13,31.75 4.13,50.48 7.94,54.29
  pour Top (isolate 0.61): 7.94,59.05 0.32,51.44 0.32,22.86 0.64,22.54 6.03,22.54 6.35,22.86 6.35,29.53 4.13,31.75 4.13,50.48 7.94,54.29
  pour Top: 18.1,23.18 5.08,23.18 5.08,26.67 13.97,26.67 14.29,26.35 14.29,24.13 14.61,23.81 18.1,23.81
  pour Bottom (isolate 0.61): 3.81,36.51 92.71,36.51 93.03,36.2 93.03,34.61 92.71,34.29 3.81,34.29
WW2_DIM
  Top 0.254: U1.32 77.36,25.83 75.56,27.62
  Top 0.305: 7.92,42.24 7.62,42.55 R10.2 | 7.92,42.24 7.63,42.24 6.67,41.27 | 7.92,42.24 RED_LM4.2
  Top 0.406: 75.56,27.62 75.25,27.94 61.91,27.94 60.64,29.21 43.5,29.21 42.55,30.16 25.4,30.16 24.45,31.11 10.16,31.11 6.67,34.61 6.67,41.27
WW_DIM  (via drill 0.61)
  Top 0.254: U1.17 85.29,17.35 86.68,18.73
  Top 0.305: 84.12,42.24 83.82,42.55 R7.2 | 84.12,42.24 83.83,42.24 82.87,41.27 | 84.12,42.24 RED_LM3.2
  Top 0.406: 86.68,18.73 v89.22,21.27 | 82.87,41.27 82.87,31.75 v81.6,30.48
  Bottom 1.016: v81.6,30.48 89.22,24.13 v89.22,21.27

### Text on the board
Milling: PWR | RST